# Altium project PCB_Project1.PrjPCB
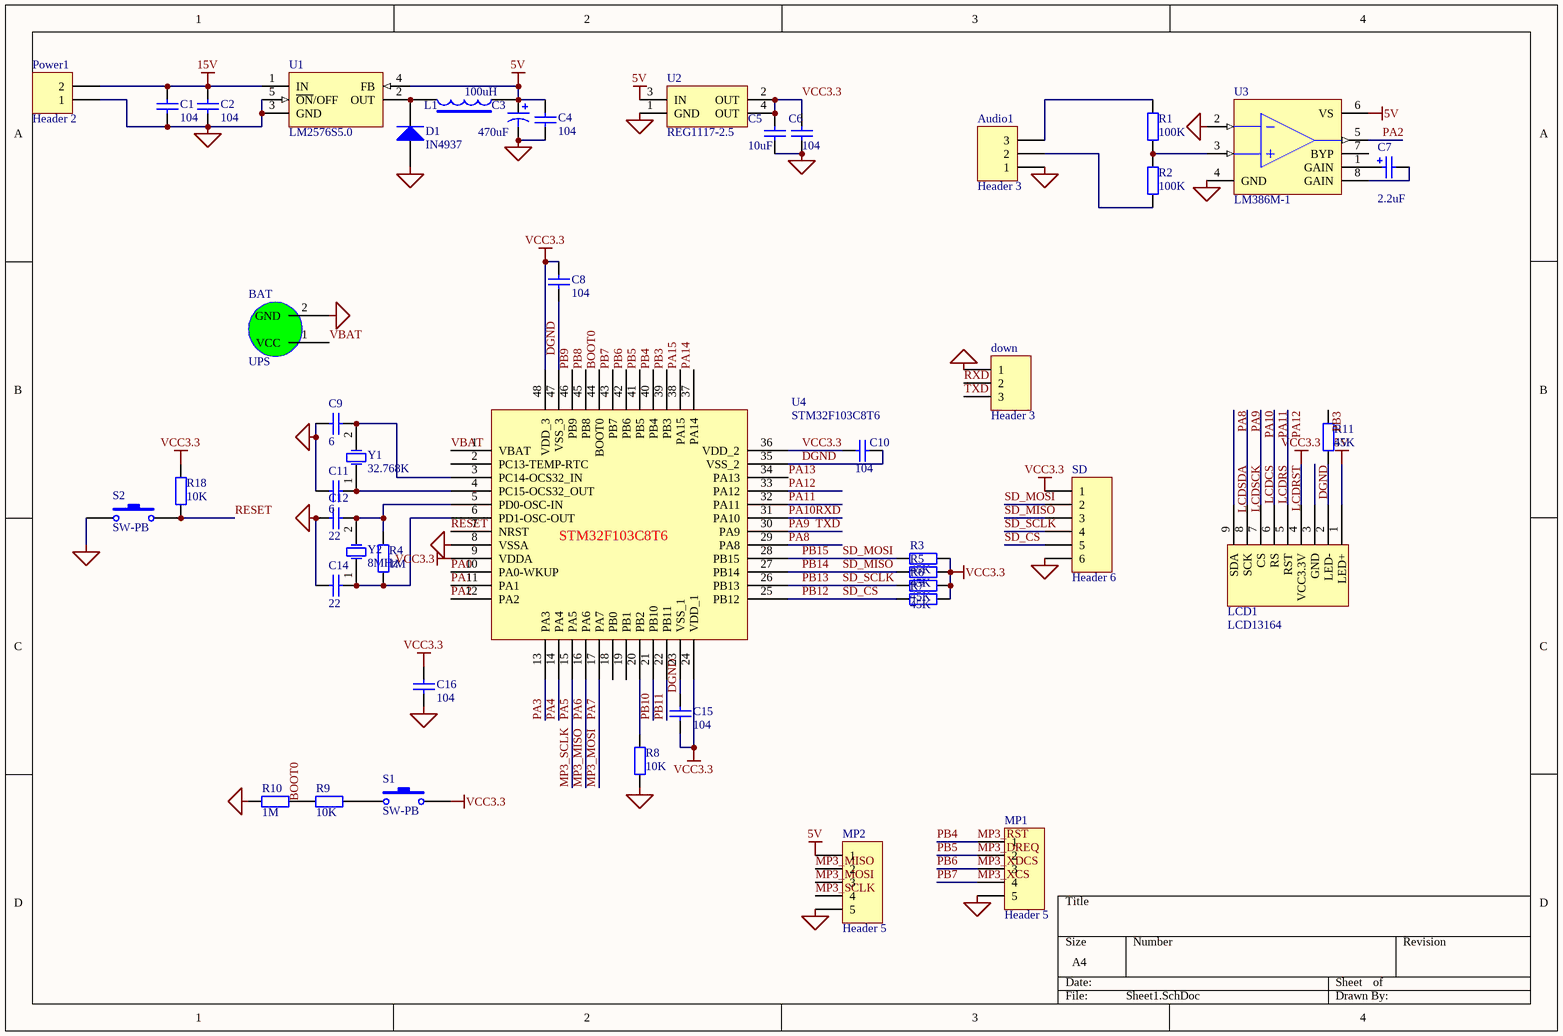
[diagram p0: Sheet1.SchDoc]
1 sheet, 45 parts. Net scope: global (net labels, ports and power ports of the same name join across sheets).
Board file: PCB1.PcbDoc

## Sheet Sheet1.SchDoc
size A4

### Parts
Audio1  Header 3  [HDR1X3]
BAT  UPS  [BAT]
C1  104  [1608[0603]]
C2  104  [1608[0603]]
C3  470uF  [RB.1/.2]
C4  104  [1608[0603]]
C5  10uF  [2012[0805]]
C6  104  [1608[0603]]
C7  value 2.2uF  [2012[0805]]
C8  value 104  [1608[0603]]
C9  value 6  [1608[0603]]
C10  value 104  [1608[0603]]
C11  value 6  [1608[0603]]
C12  value 22  [1608[0603]]
C14  value 22  [1608[0603]]
C15  value 104  [1608[0603]]
C16  value 104  [1608[0603]]
D1  IN4937  [DIODE-0.4]
down  Header 3  [HDR1X3]
L1  100uH  [HDR1X2]
LCD1  LCD13164  [HDR1X9]
MP1  Header 5  [HDR1X5]
MP2  Header 5  [HDR1X5]
Power1  Header 2  [HDR1X2]
R1  100K  [1608[0603]]
R2  100K  [1608[0603]]
R3  45K  [1608[0603]]
R4  1M  [1608[0603]]
R5  45K  [1608[0603]]
R6  45K  [1608[0603]]
R7  45K  [1608[0603]]
R8  10K  [1608[0603]]
R9  10K  [1608[0603]]
R10  1M  [1608[0603]]
R11  45K  [1608[0603]]
R18  10K  [1608[0603]]
S1  SW-PB  [SPST-2]
S2  SW-PB  [SPST-2]
SD  Header 6  [HDR1X6]
U1  LM2576S5.0  [HDR1X5]
U2  REG1117-2.5  [ZZ311]
U3  LM386M-1  [SOP-8 - duplicate]
U4  STM32F103C8T6
Y1  32.768K  [BCY-W2/D3.1]
Y2  8MHz  [SPST-2]

### Nets
5V: C3.1 C4.1 L1.1 LCD1.1(LED+) MP2.1 U1.4(FB) U2.3(IN) U3.6(VS)
15V: C1.1 C2.1 Power1.2 U1.1(IN)
DGND: Audio1.1 BAT.2(GND) C1.2 C2.2 C3.2 C4.2 C5.2 C6.1 C8.1 C9.1 C10.2 C11.1 C12.1 C14.1 C15.1 C16.1 D1.1(A) down.1 LCD1.3(GND) MP1.5 MP2.5 Power1.1 R8.2 R10.1 S2.1 SD.6 U1.3(GND) U1.5(~{ON}/OFF) U2.1(GND) U3.2(IN-) U3.4(GND) U4.8(VSSA) U4.23(VSS_1) U4.35(VSS_2) U4.47(VSS_3)
VCC3.3: C5.1 C6.2 C8.2 C10.1 C15.2 C16.2 LCD1.4(VCC3.3V) R3.1 R5.1 R6.1 R7.1 R18.1 S1.2 SD.1 U2.2(OUT) U2.4(OUT) U4.9(VDDA) U4.24(VDD_1) U4.36(VDD_2) U4.48(VDD_3)
BOOT0: R9.1 R10.2 U4.44(BOOT0)
LCDCS: down.2 LCD1.7(CS) U4.31(PA10)  [also labelled PA10, RXD]
LCDRS: LCD1.6(RS) U4.32(PA11)  [also labelled PA11]
LCDRST: LCD1.5(RST) U4.33(PA12)  [also labelled PA12]
LCDSCK: down.3 LCD1.8(SCK) U4.30(PA9)  [also labelled PA9, TXD]
LCDSDA: LCD1.9(SDA) U4.29(PA8)  [also labelled PA8]
MP3_DREQ: MP1.2 U4.41(PB5)  [also labelled PB5]
MP3_MISO: MP2.2 U4.16(PA6)  [also labelled PA6]
MP3_MOSI: MP2.3 U4.17(PA7)  [also labelled PA7]
MP3_RST: MP1.1 U4.40(PB4)  [also labelled PB4]
MP3_SCLK: MP2.4 U4.15(PA5)  [also labelled PA5]
MP3_XCS: MP1.4 U4.43(PB7)  [also labelled PB7]
MP3_XDCS: MP1.3 U4.42(PB6)  [also labelled PB6]
PA0: U4.10(PA0-WKUP)
PA1: U4.11(PA1)
PA2: U3.5(OUT) U4.12(PA2)
PA3: U4.13(PA3)
PA4: U4.14(PA4)
PA13: U4.34(PA13)
PA14: U4.37(PA14)
PA15: U4.38(PA15)
PB3: R11.1 U4.39(PB3)
PB8: U4.45(PB8)
PB9: U4.46(PB9)
PB10: U4.21(PB10)
PB11: U4.22(PB11)
PB12: R7.2 SD.5 U4.25(PB12)  [also labelled SD_CS]
PB13: R6.2 SD.4 U4.26(PB13)  [also labelled SD_SCLK]
PB14: R5.2 SD.3 U4.27(PB14)  [also labelled SD_MISO]
PB15: R3.2 SD.2 U4.28(PB15)  [also labelled SD_MOSI]
RESET: R18.2 S2.2 U4.7(NRST)
VBAT: BAT.1(VCC) U4.1(VBAT)
NetAudio1_2: Audio1.2 R2.2
NetAudio1_3: Audio1.3 R1.1
NetC7_1: C7.1 U3.1(GAIN)
NetC7_2: C7.2 U3.8(GAIN)
NetC9_2: C9.2 U4.3(PC14-OCS32_IN) Y1.2(OSC2)
NetC11_2: C11.2 U4.4(PC15-OCS32_OUT) Y1.1(OSC1)
NetC12_2: C12.2 R4.1 U4.5(PD0-OSC-IN) Y2.2(OSC2)
NetC14_2: C14.2 R4.2 U4.6(PD1-OSC-OUT) Y2.1(OSC1)
NetD1_2: D1.2(K) L1.2 U1.2(OUT)
NetLCD1_2: LCD1.2(LED-) R11.2
NetR1_2: R1.2 R2.1 U3.3(IN+)
NetR8_1: R8.1 U4.20(PB2)
NetR9_2: R9.2 S1.1

Not connected (* = marked no-connect by the designer): U3 7(BYP); U4 2(PC13-TEMP-RTC) 18(PB0) 19(PB1)

### Library data of the parts
Audio1 down = Header 3: Header, 3-Pin; LatestRevisionDate: 17-Jul-2002; LatestRevisionNote: Re-released for DXP Platform.; Publisher: Altium Limited
C1 C2 C4-C6 C8-C12 C14-C16 = Cap: Capacitor; Published: 8-Jun-2000; LatestRevisionDate: 17-Jul-2002; LatestRevisionNote: Re-released for DXP Platform.; Publisher: Altium Limited
C3 C7 = Cap Pol1: Polarized Capacitor (Radial); Published: 8-Jun-2000; Publisher: Altium Limited
  C3: LatestRevisionDate: 17-Jul-2002; LatestRevisionNote: Re-released for DXP Platform.
  C7: Revision: July-2002: Re-released for DXP Platform.
D1 = Diode 1N4007: 1 Amp General Purpose Rectifier; Published: 8-Jun-2000; LatestRevisionDate: 17-Jul-2002; LatestRevisionNote: Re-released for DXP Platform.; DatasheetDocument: 1998; PackageDocument: Aug-1999; PackageReference: DO-41; Publisher: Altium Limited; ComponentLink1Description: Manufacturer Link; ComponentLink1URL: http://www.fairchildsemi.com/; Code_JEDEC: DO-204-AL
L1 = INDUCTOR2
MP1 MP2 = Header 5: Header, 5-Pin; LatestRevisionDate: 17-Jul-2002; LatestRevisionNote: Re-released for DXP Platform.; Publisher: Altium Limited
Power1 = Header 2: Header, 2-Pin; LatestRevisionDate: 17-Jul-2002; LatestRevisionNote: Re-released for DXP Platform.; Publisher: Altium Limited
R1-R11 R18 = Res2: Resistor; Published: 8-Jun-2000; LatestRevisionDate: 17-Jul-2002; LatestRevisionNote: Re-released for DXP Platform.; Publisher: Altium Limited
S1 S2 = SW-PB: Switch; Published: 24-Mar-1999; LatestRevisionDate: 17-Jul-2002; LatestRevisionNote: Re-released for DXP Platform.; PackageReference: SPST-2; Publisher: Altium Limited
SD = Header 6: Header, 6-Pin; LatestRevisionDate: 17-Jul-2002; LatestRevisionNote: Re-released for DXP Platform.; Publisher: Altium Limited
U1 = LM2576S5.0: Simple Switcher 3A Step Down Voltage Regulator; Note: Tab is connected to GND; Published: 15-Apr-2002; DatasheetDocument: Jun-1999; PackageReference: TS5B; Publisher: Altium Limited; ComponentLink1Description: Manufacturer Link; ComponentLink1URL: http://www.national.com/
U2 = REG1117-3.3: 800mA and 1A Low Dropout Positive Regulator 2.85V, 3.3V, 5V, and Adjustable; PackageDocument: revC; Published: 8-Jun-2000; LatestRevisionDate: 17-Jul-2002; LatestRevisionNote: Re-released for DXP Platform.; DatasheetDocument: Sep-1997; PackageReference: ZZ311; Publisher: Altium Limited; ComponentLink1Description: Manufacturer Link; ComponentLink1URL: http://www.ti.com/
U3 = LM386M-1: Low-Voltage Audio Power Amplifier; Package Information: Latest Revision: Sep-1997; Code - JEDEC: MS-012-AA; Code - IPC: SO8; Published: 15-Apr-2002; Datasheet: Latest Revision: Sep-1997; Package Reference: M08A; Publisher: Altium Limited
Y1 Y2 = XTAL: Crystal Oscillator; Published: 8-Jun-2000; LatestRevisionDate: 17-Jul-2002; LatestRevisionNote: Re-released for DXP Platform.; Publisher: Altium Limited